# EAGLE design root (EAGLE 7.2.0)
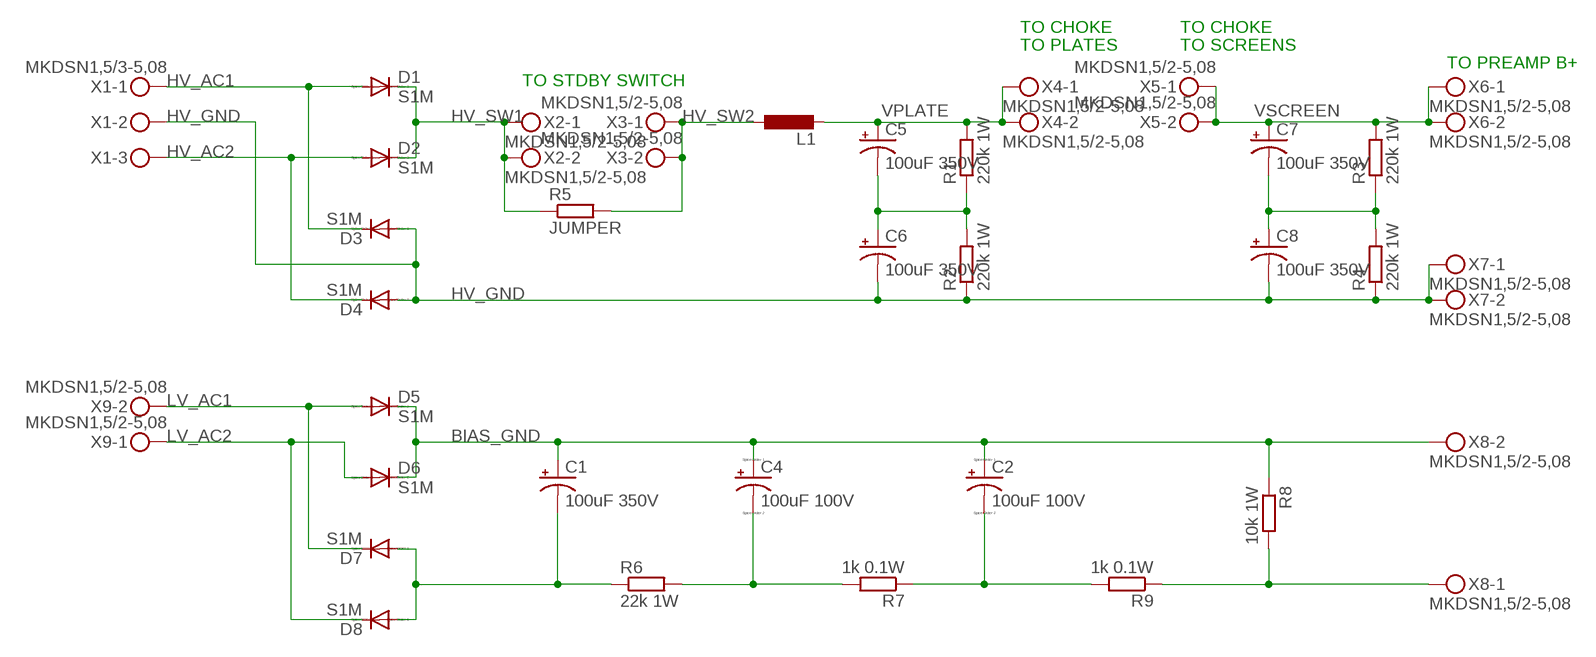
[diagram p0: schematic, sheet 1]

## Parts
C1  100uF 350V  CPOL-USE7.5-18  [E7,5-18]
C2  100uF 100V  CPOL-USF  [PANASONIC_F]
C4  100uF 100V  CPOL-USF  [PANASONIC_F]
C5  100uF 350V  CPOL-USE7.5-18  [E7,5-18]
C6  100uF 350V  CPOL-USE7.5-18  [E7,5-18]
C7  100uF 350V  CPOL-USE7.5-18  [E7,5-18]
C8  100uF 350V  CPOL-USE7.5-18  [E7,5-18]
D1  S1M  [SMA]
D2  S1M  [SMA]
D3  S1M  [SMA]
D4  S1M  [SMA]
D5  S1M  [SMA]
D6  S1M  [SMA]
D7  S1M  [SMA]
D8  S1M  [SMA]
L1  L-EUL4516C  [L4516C]
R1  220k 1W  R-EU_R2512  [R2512]
R2  220k 1W  R-EU_R2512  [R2512]
R3  220k 1W  R-EU_R2512  [R2512]
R4  220k 1W  R-EU_R2512  [R2512]
R5  JUMPER  R-EU_R1206  [R1206]
R6  22k 1W  R-EU_R2512  [R2512]
R7  1k 0.1W  R-EU_R0603  [R0603]
R8  10k 1W  R-EU_R2512  [R2512]
R9  1k 0.1W  R-EU_R0603  [R0603]
X1  MKDSN1,5/3-5,08  [MKDSN1,5/3-5,08]
X2  MKDSN1,5/2-5,08  [MKDSN1,5/2-5,08]
X3  MKDSN1,5/2-5,08  [MKDSN1,5/2-5,08]
X4  MKDSN1,5/2-5,08  [MKDSN1,5/2-5,08]
X5  MKDSN1,5/2-5,08  [MKDSN1,5/2-5,08]
X6  MKDSN1,5/2-5,08  [MKDSN1,5/2-5,08]
X7  MKDSN1,5/2-5,08  [MKDSN1,5/2-5,08]
X8  MKDSN1,5/2-5,08  [MKDSN1,5/2-5,08]
X9  MKDSN1,5/2-5,08  [MKDSN1,5/2-5,08]

## Nets
BIAS_GND: C1.+ C2.+ C4.+ D5.C D6.C R8.1 X8.2
HV_AC1: D1.A D3.C X1.1
HV_AC2: D2.A D4.C X1.3
HV_GND: C6.- C8.- D3.A D4.A R2.1 R4.1 X1.2 X7.1 X7.2
HV_SW1: D1.C D2.C R5.1 X2.1 X2.2
HV_SW2: L1.1 R5.2 X3.1 X3.2
LV_AC1: D5.A D7.C X9.2
LV_AC2: D6.A D8.C X9.1
N$1: C5.- C6.+ R1.1 R2.2
N$2: R8.2 R9.1 X8.1
N$3: C4.- R6.2 R7.2
N$4: C7.- C8.+ R3.1 R4.2
N$5: C2.- R7.1 R9.2
N$6: C1.- D7.A D8.A R6.1
VPLATE: C5.+ L1.2 R1.2 X4.1 X4.2
VSCREEN: C7.+ R3.2 X5.1 X5.2 X6.1 X6.2

## Notes on the sheet
- TO CHOKE | TO CHOKE
- TO PLATES | TO SCREENS
- TO PREAMP B+
- TO STDBY SWITCH

## Library data of the parts
C1 C5-C8 = rcl:CPOL-US: POLARIZED CAPACITOR, American symbol
C2 C4 = resistor:CPOL-US: POLARIZED CAPACITOR, American symbol
D1-D8 = diode:S1M
L1 = resistor:L-EU: INDUCTOR, European symbol
R1-R4 R6 R8 = rcl:R-EU_: RESISTOR, European symbol
R5 R7 R9 = resistor:R-EU_: RESISTOR, European symbol
X1 = con-phoenix-508:MKDSN1,5/3-5,08: MKDSN 1,5/ 3-5,08 Printklemme Nennstrom: 13,5 A Nennspannung: 250 V Rastermaß: 5,08 mm Polzahl: 3 Anschlussart: Schraubanschluss Montage: Löten Anschlussrichtung Leiter/Platine: 0 ° Artikelnummer: 1729131 Source: http://eshop.phoenixcontact.com .. 1729131.pdf
X2-X9 = con-phoenix-508:MKDSN1,5/2-5,08: MKDSN 1,5/ 2-5,08 Printklemme Nennstrom: 13,5 A Nennspannung: 250 V Rastermaß: 5,08 mm Polzahl: 2 Anschlussart: Schraubanschluss Montage: Löten Anschlussrichtung Leiter/Platine: 0 ° Artikelnummer: 1729128 Source: http://eshop.phoenixcontact.com .. 1729128.pdf

## Net classes
0 default: width 0.203 mm, clearance 0.203 mm
1 high current: width 0.508 mm, clearance 0.203 mm

## Board
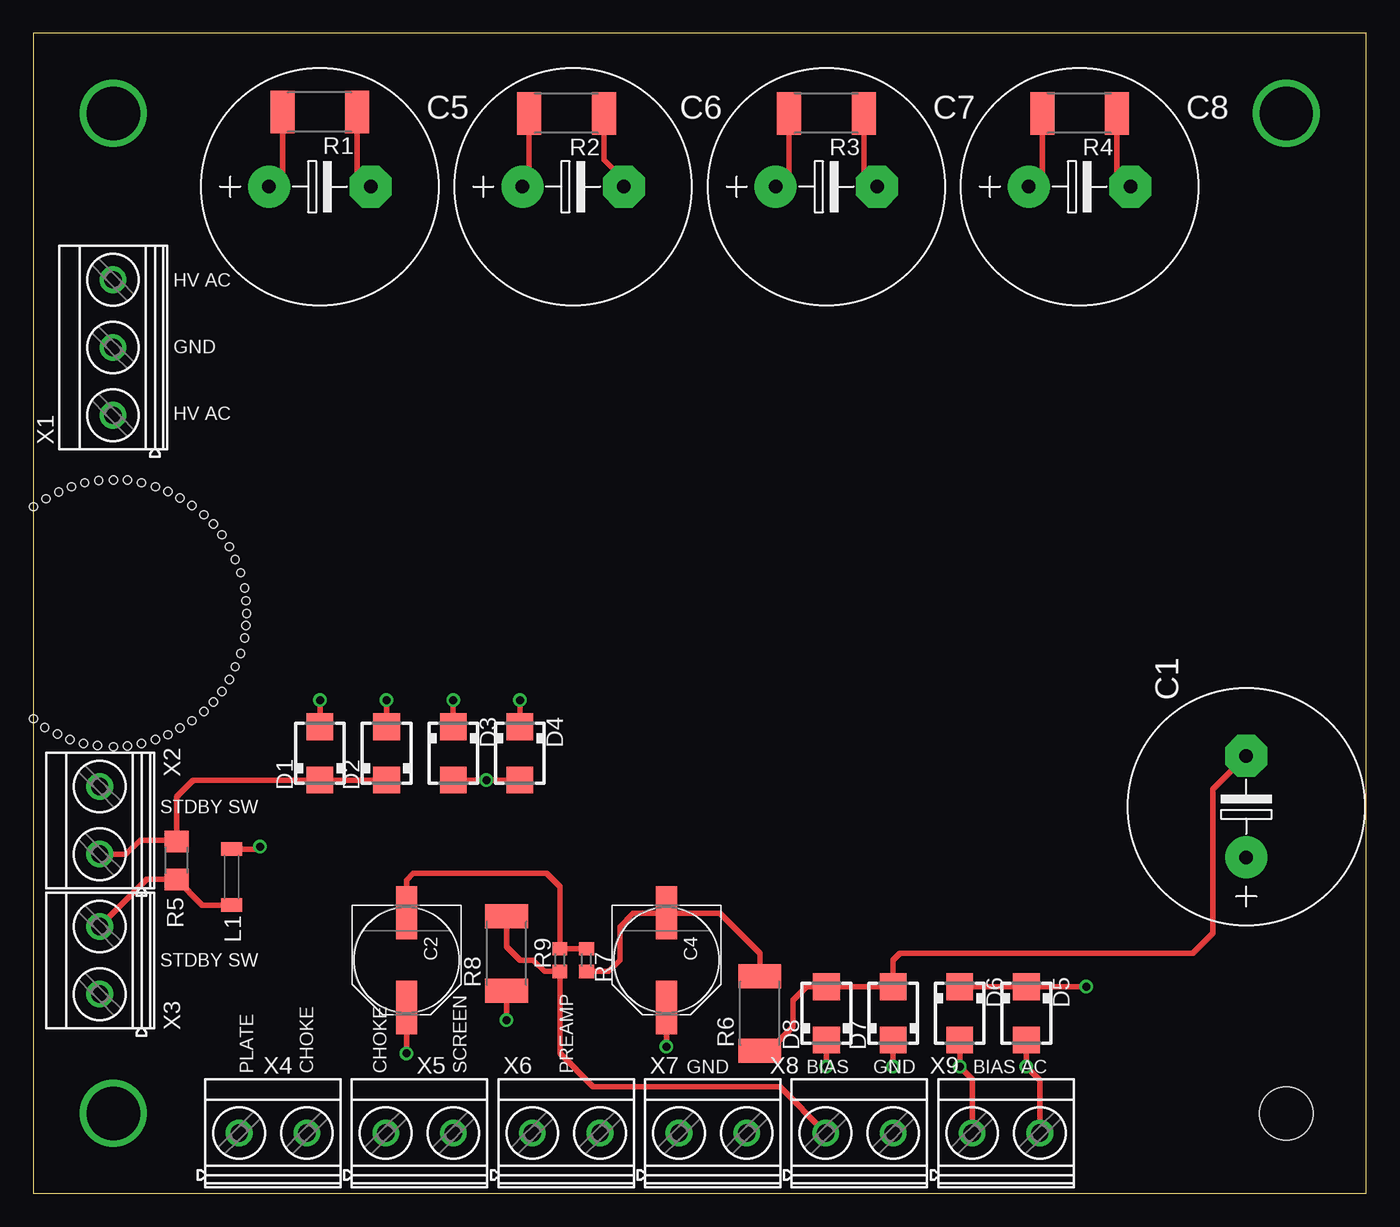
[diagram p1: board, top side]
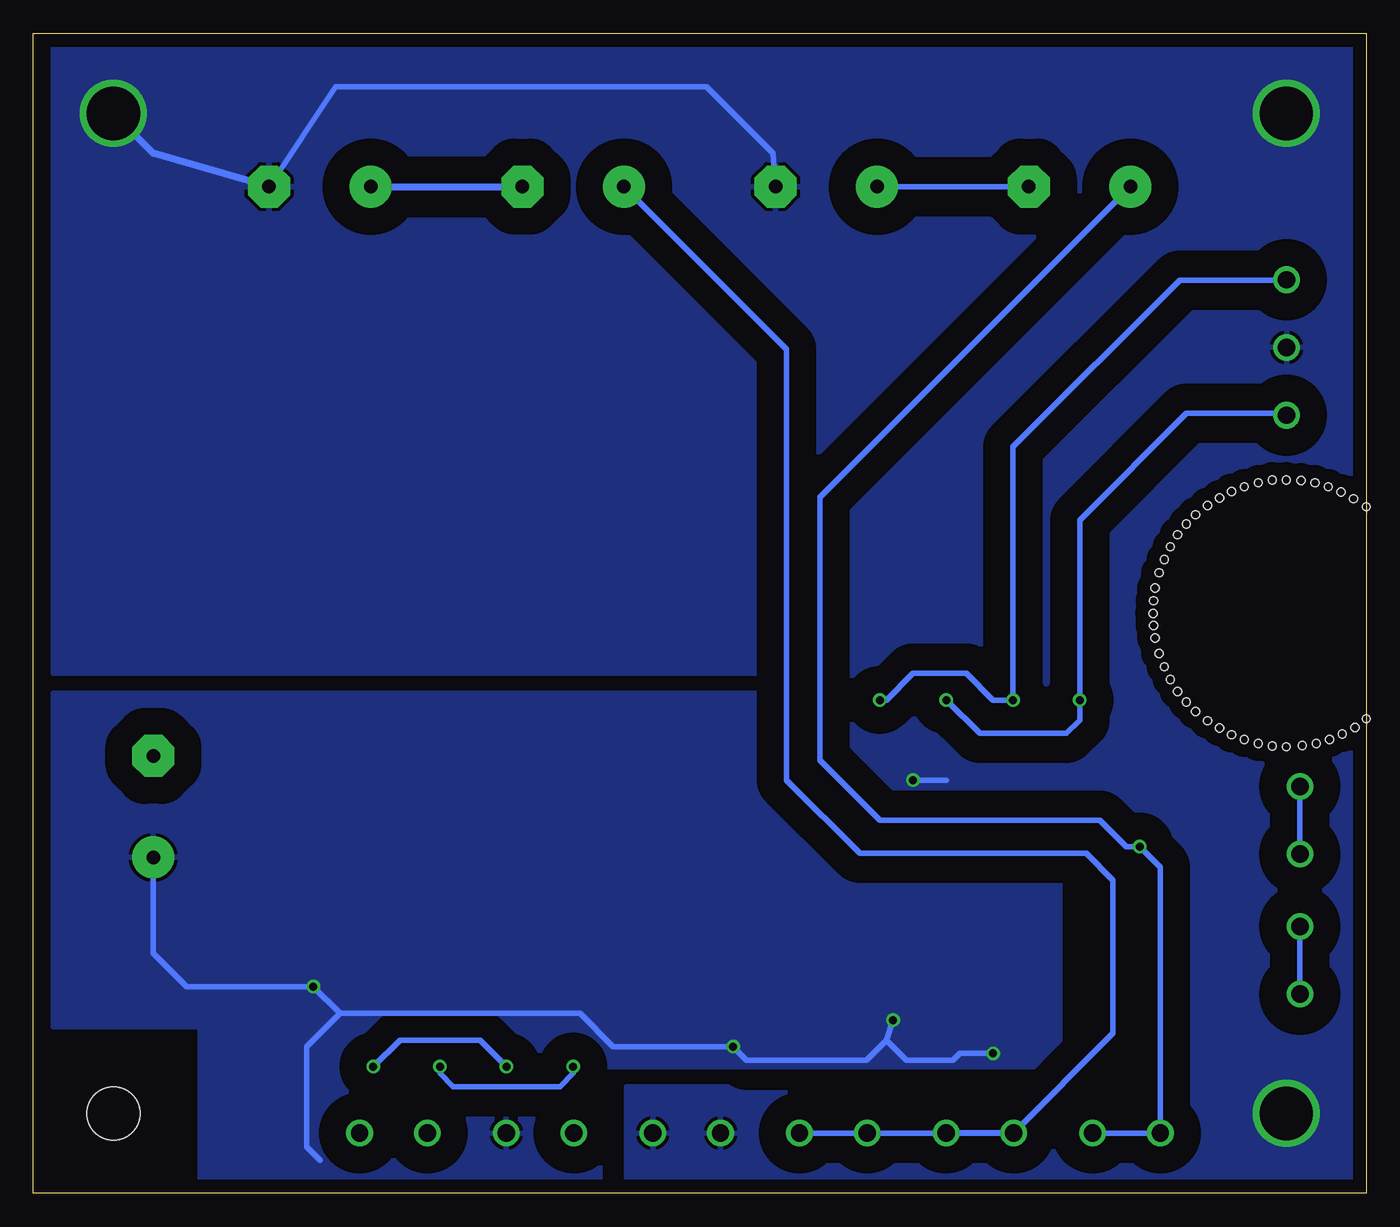
[diagram p2: board, bottom side, seen from below]

Size 100 x 87 mm. Coordinates in mm from the lower left corner, seen from the top.
Outline: 0,0 100,0 100,87 0,87 0,0
Copper layers (1*16): Top 0.035mm / dielectric 1.5mm / Bottom 0.035mm
Design rules "default *": minimum track width 20mil, minimum drill 24mil, track to track 80mil, track to pad 80mil, pad to pad 80mil, via to via 80mil, smd to smd 20mil, copper to edge 40mil, drill to drill 8mil, minimum pad ring 10mil, minimum via ring 8mil, stop-mask expansion 4mil, vias tented up to drill 0mil, thermal gap 10mil
Holes 4 mm at 94,6
Holes 0.6 mm at 0,35.6 0,51.5 16,43.5 6,53.5 6,33.5 0.95,52.1 1.9,52.6 2.85,53 3.85,53.3 4.9,53.45 0.85,34.95 1.8,34.45 2.75,34.05 3.75,33.75 4.8,33.6 12.8,50.9 7.05,53.5 8.1,53.3 9.15,53 10.1,52.65 11,52.15 11.9,51.6 13.5,50.2 14.15,49.4 14.7,48.5 15.15,47.55 15.55,46.55 15.85,45.4 15.95,44.45 12.8,36.15 7.05,33.55 8.1,33.75 9.15,34.05 10.1,34.4 11,34.9 11.9,35.45 13.5,36.85 14.15,37.65 14.7,38.55 15.15,39.5 15.55,40.5 15.85,41.65 15.95,42.6
tKeepout: area 0,0 to 12,12; area 88,0 to 100,12; area 0,75 to 12,87; area 88,75 to 100,87

### Footprints (pad centres in the part's own frame; a part is rotated, then mirrored left to right if it is on the bottom)
E7,5-18 = drill 1.016 pad 3.15: + -3.81,0 | drill 1.016 pad 3.15 octagon: - 3.81,0
PANASONIC_F = smd 4 x 1.6: + 3.55,0; - -3.55,0
SMA = smd 2 x 2: A 2,0; C -2,0
L4516C = smd 1 x 1.6: 1 -2.1,0; 2 2.1,0
R2512 = smd 1.8 x 3.2: 1 -2.8,0; 2 2.8,0
R1206 = smd 1.6 x 1.803: 1 -1.422,0; 2 1.422,0
R0603 = smd 1 x 1.1: 1 -0.85,0; 2 0.85,0
MKDSN1,5/3-5,08 = drill 1.3 pad 2: 1 -7.641,0.025; 2 -2.561,0.025; 3 2.519,0.025
MKDSN1,5/2-5,08 = drill 1.3 pad 2: 1 -2.561,0.025; 2 2.519,0.025

### Placement (x,y rotation side)
C1  91,29 90 top
C2  28,17.5 270 top
C4  47.5,17.5 270 top
C5  21.5,75.5 0 top
C6  40.5,75.5 0 top
C7  59.5,75.5 0 top
C8  78.5,75.5 0 top
D1  21.5,33 90 top
D2  26.5,33 90 top
D3  31.5,33 270 top
D4  36.5,33 270 top
D5  74.5,13.5 270 top
D6  69.5,13.5 270 top
D7  64.5,13.5 90 top
D8  59.5,13.5 90 top
L1  14.88,23.72 90 top
R1  21.5,81.1 180 top
R2  40,81 180 top
R3  59.5,81 180 top
R4  78.5,81 180 top
R5  10.76,24.96 270 top
R6  54.5,13.5 90 top
R7  41.5,17.5 270 top
R8  35.5,18 90 top
R9  39.5,17.5 90 top
X1  6,66 90 top
X2  5,28 90 top
X3  5,17.5 90 top
X4  18,4.5 0 top
X5  29,4.5 0 top
X6  40,4.5 0 top
X7  51,4.5 0 top
X8  62,4.5 0 top
X9  73,4.5 0 top

### Tracks (layer width: path | path; a pad name or v marks a point on that pad's centre or on a via)
BIAS_GND  (via drill 0.6)
  Top 0.406: v79,15.5 D5.C D6.C | C2.+ v28,10.5 | R8.1 v35.5,13 | C4.+ v47.5,11
  Bottom 0.406: C1.+ 91,18 88.5,15.5 v79,15.5 77,13.5 | v28,10.5 30.5,10.5 31,10 34.5,10 36,11.5 | v35.5,13 36,11.5 | 36,11.5 37.5,10 46.5,10 v47.5,11 56.5,11 59,13.5 77,13.5 | 78.5,2.5 79.5,3.5 79.5,11 77,13.5
  pour Bottom: 23,9.5 23,14 23,26 41.5,26 41.5,26.5 41.5,37.5 98.5,37.5 98.5,33 98.5,12.5 87.5,12.5 87.5,1 57.5,1 57.5,3.5 57.5,9.5 26.5,9.5
HV_AC1  (via drill 0.6)
  Top 0.406: D1.A v21.5,37 | D3.C v31.5,37
  Bottom 0.406: X1.1 6.12,58.5 9,58.5 10,58.5 13.5,58.5 21.5,50.5 v21.5,37 21.5,35.5 22.5,34.5 29,34.5 v31.5,37
HV_AC2  (via drill 0.6)
  Top 0.406: D2.A v26.5,37 | D4.C v36.5,37
  Bottom 0.406: X1.3 5.99,68.5 14,68.5 26.5,56 v26.5,37 28,37 30,39 34,39 36,37 v36.5,37
HV_GND  (via drill 0.6, 4)
  Top 0.406: D4.A v34,31 D3.A | R2.1 42.8,77.51 44.31,76 C6.- | R4.1 81.3,76.51 C8.-
  Bottom 0.406: v34,31 D3.A | C6.- 44.5,78 49.5,83 77.31,83 C8.-
  Bottom 0.508: 6.5,6.5 v6,6 | v94,81 91,78 C8.-
  other vias: 6,81
  pour Bottom: 21.5,8 21.5,16.5 21.5,27.5 40,27.5 40,39 98.5,39 98.5,60 98.5,86.5 1,86.5 1,1 55.5,1 55.5,8
HV_SW1
  Top 0.406: D2.C D1.C 12,31 10.76,29.76 R5.1 10.64,26.5 8,26.5 6.94,25.44 X2.1
  Bottom 0.406: X2.2 X2.1
HV_SW2
  Top 0.406: L1.1 12.68,21.62 R5.2 8.49,23.54 X3.2
  Bottom 0.406: X3.2 X3.1
LV_AC1  (via drill 0.6)
  Top 0.406: D7.C v64.5,9.5 64.52,9.48 | D5.A v74.5,9.5 75.52,8.48 X9.2
  Bottom 0.406: v64.5,9.5 66.5,11.5 72.5,11.5 v74.5,9.5
LV_AC2  (via drill 0.6)
  Top 0.406: D8.C v59.5,9.5 59.44,9.44 | D6.A v69.5,9.5 70.44,8.56 X9.1
  Bottom 0.406: v59.5,9.5 59.5,9 60.5,8 68.5,8 69.5,9 v69.5,9.5
N$1
  Top 0.406: R1.1 24.3,76.51 C5.- | R2.2 37.2,76.01 C6.+
  Bottom 0.406: C5.- C6.+
N$2
  Top 0.406: X8.1 59.44,4.56 56,8 42,8 39.5,10.5 R9.1 38.35,16.65 37.5,17.5 36.5,17.5 35.5,18.5 R8.2
N$3
  Top 0.406: R6.2 54.5,18 51.5,21 47.55,21 C4.- 47.45,21 45,21 44,20 44,17.5 43.15,16.65 R7.2
N$4
  Top 0.406: R3.1 62.3,76.51 C7.- | R4.2 75.7,76.51 C8.+
  Bottom 0.508: C8.+ C7.-
N$5
  Top 0.406: C2.- 28,23.5 28.5,24 38.5,24 39.5,23 R9.2 R7.1
N$6
  Top 0.406: C1.- 88.5,30.31 88.5,19.5 87,18 65,18 64.5,17.5 D7.A D8.A 58,15.5 57,14.5 57,12.5 55.5,11 54.8,11 R6.1
VPLATE  (via drill 0.6)
  Top 0.406: R1.2 18.7,76.51 C5.+ | L1.2 16.82,25.82 v17,26
  Bottom 0.406: C5.+ 41,52.19 41,32.5 36.5,28 20,28 18,26 v17,26 15.44,24.44 X4.1 X4.2
VSCREEN
  Top 0.406: R3.2 56.7,76.51 C7.+
  Bottom 0.406: 26.44,4.56 X5.1 X5.2 | 26.44,4.56 19,12 19,23.5 21,25.5 38,25.5 43.5,31 43.5,63.31 C7.+ | X6.2 38,4.53 X6.1 X5.2 | 26.44,4.56 31.48,4.56 X5.2

### Text on the board
tNames: HV AC | GND | HV AC | STDBY SW | STDBY SW | PLATE | CHOKE | CHOKE | SCREEN | PREAMP | GND | BIAS | GND | BIAS AC